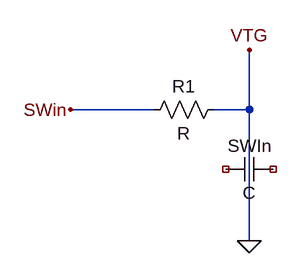
[diagram p0: schematic Question_7b.asc]
Question_7b.asc, the LTspice schematic file:
Version 4
SHEET 1 880 680
WIRE 112 144 0 144
WIRE 240 144 240 64
WIRE 240 144 192 144
WIRE 240 320 240 144
FLAG 240 64 VTG
FLAG 0 144 SWin
FLAG 240 320 0
SYMBOL res 208 128 R90
WINDOW 0 0 56 VBottom 2
WINDOW 3 32 56 VTop 2
SYMATTR InstName R1
SYMBOL cap 272 208 R90
WINDOW 0 0 32 VBottom 2
WINDOW 3 32 32 VTop 2
SYMATTR InstName SWIn

The netlist it stands for:
* Question_7b.asc
R1 0 SWin R
C§SWIn NC_01 NC_02 C
.backanno
.end